# Altium schematic sheet S2C_FrontpanelInterface.SchDoc
size A4; SheetNumber: 18
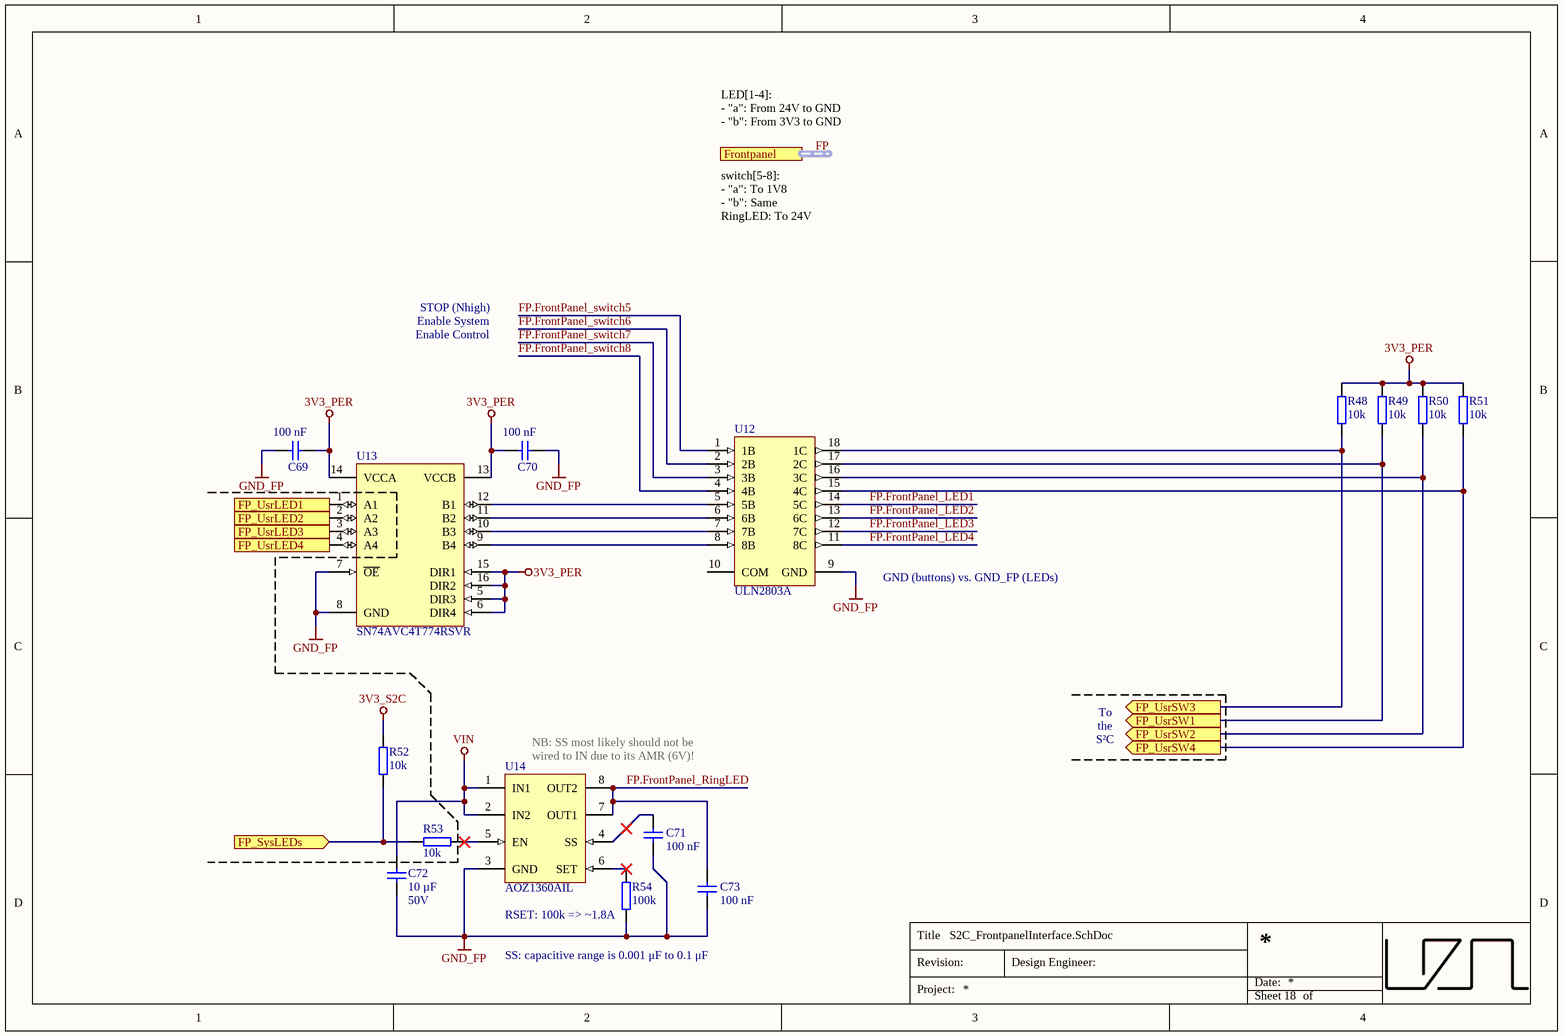
[diagram p0: S2C_FrontpanelInterface.SchDoc]

## Parts
C69  100 nF  [C_0603_TE]
C70  100 nF  [C_0603_TE]
C71  100 nF  [C_0603_TE]
C72  10 µF  Voltage: 50V  [C_1206_TE]
C73  100 nF  [C_0603_TE]
R48  10k  [R_0603_TE]
R49  10k  [R_0603_TE]
R50  10k  [R_0603_TE]
R51  10k  [R_0603_TE]
R52  10k  [R_0603_TE]
R53  10k  [R_0603_TE]
R54  100k  [R_0603_TE]
U12  ULN2803A  [FP-SOICW-18LD-PL-1-IPC_B]
U13  SN74AVC4T774RSVR  [QFN40P260X180X55-16N]
U14  AOZ1360AIL  [SOIC127P600X175-8N]

## Ports
FP_SysLEDs (in), FP_UsrLED1 (in), FP_UsrLED2 (in), FP_UsrLED3 (in), FP_UsrLED4 (in), FP_UsrSW1 (out), FP_UsrSW2 (out), FP_UsrSW3 (out), FP_UsrSW4 (out), Frontpanel (harness Frontpanel)

## Nets
3V3_PER: C69.2 C70.1 R48.2 R49.2 R50.2 R51.2 U13.5(DIR3) U13.6(DIR4) U13.13(VCCB) U13.14(VCCA) U13.15(DIR1) U13.16(DIR2)
3V3_S2C: R52.1
GND_FP: C69.1 C70.2 C71.2 C72.1 C73.2 R54.2 U12.9(GND) U13.7(~{OE}) U13.8(GND) U14.3(GND)
VIN: C72.2 U14.1(IN1) U14.2(IN2)
FP.FrontPanel_LED1: U12.14(5C)
FP.FrontPanel_LED2: U12.13(6C)
FP.FrontPanel_LED3: U12.12(7C)
FP.FrontPanel_LED4: U12.11(8C)
FP.FrontPanel_RingLED: C73.1 U14.7(OUT1) U14.8(OUT2)
FP.FrontPanel_switch5: U12.1(1B)
FP.FrontPanel_switch6: U12.2(2B)
FP.FrontPanel_switch7: U12.3(3B)
FP.FrontPanel_switch8: U12.4(4B)
FP_SysLEDs: R52.2 R53.1 ; port FP_SysLEDs
FP_UsrLED1: U13.1(A1) ; port FP_UsrLED1
FP_UsrLED2: U13.2(A2) ; port FP_UsrLED2
FP_UsrLED3: U13.3(A3) ; port FP_UsrLED3
FP_UsrLED4: U13.4(A4) ; port FP_UsrLED4
FP_UsrSW1: R49.1 U12.17(2C) ; port FP_UsrSW1
FP_UsrSW2: R50.1 U12.16(3C) ; port FP_UsrSW2
FP_UsrSW3: R48.1 U12.18(1C) ; port FP_UsrSW3
FP_UsrSW4: R51.1 U12.15(4C) ; port FP_UsrSW4
NetC71_1: C71.1 U14.4(SS)
NetR53_2: R53.2 U14.5(EN)
NetR54_1: R54.1 U14.6(SET)
NetU12_5: U12.5(5B) U13.12(B1)
NetU12_6: U12.6(6B) U13.11(B2)
NetU12_7: U12.7(7B) U13.10(B3)
NetU12_8: U12.8(8B) U13.9(B4)

Not connected (* = marked no-connect by the designer): U12 10(COM)

## Buses and harness runs
harness FP = port Frontpanel

## Notes on the sheet
- LED[1-4]:
  - "a": From 24V to GND
  - "b": From 3V3 to GND
- switch[5-8]:
  - "a": To 1V8
  - "b": Same
- RingLED: To 24V
- STOP (Nhigh)
- Enable System
- Enable Control
- GND (buttons) vs. GND_FP (LEDs)
- To
- (near U14) NB: SS most likely should not be wired to IN due to its AMR (6V)!
- the
- S²C
- (near R54) RSET: 100k => ~1.8A
- SS: capacitive range is 0.001 μF to 0.1 μF
- Title
- Revision:
- Design Engineer:
- Date:
- Project:
- Sheet
- of

## Library data of the parts
C69 C70 = UZgen_C_0603_100nF_50V_X7R: Generic capacitor; Manufacturer: UZgen; Voltage: 50V; Tolerance: 10 %; Created from: AGeiger; Manufacturer Part Number: UZgen_C_0603_100nF_50V_X7R; PartID: 1; Created On: 02/07/2024 14:42:23; Value: 100 nF; Device Package: 0603; Technology: X7R; Mounting Type: SMD; Last Updated: 08/08/2024 15:01:15
C71 C73 = UZgen_C_0603_100nF_50V_X7R: Generic capacitor; Manufacturer: UZgen; Tolerance: 10 %; Voltage: 50V; Created from: AGeiger; Technology: X7R; Value: 100 nF; Manufacturer Part Number: UZgen_C_0603_100nF_50V_X7R; PartID: 1; Created On: 02/07/2024 14:42:23; Device Package: 0603; Mounting Type: SMD; Last Updated: 08/08/2024 15:01:15
C72 = UZgen_C_1206_10uF_50V_X7R: Generic capacitor; Manufacturer: UZgen; Tolerance: 10 %; Created from: MGeier; Value: 10 µF; Manufacturer Part Number: UZgen_C_1206_10uF_50V_X7R; PartID: 5807; Created On: 20/03/2025 14:05:00; Device Package: 1206; Technology: X7R; Mounting Type: SMD; Last Updated: 20/03/2025 14:05:00
R48-R53 = UZgen_R_0603_10k: Generic resistor; Manufacturer: UZgen; Tolerance: 1 %; Created from: AGeiger; Manufacturer Part Number: UZgen_R_0603_10k; PartID: 1; Created On: 02/07/2024 14:34:53; Value: 10k; Device Package: 0603; Mounting Type: SMD; Last Updated: 02/07/2024 14:37:16
R54 = UZgen_R_0603_100k: Generic resistor; Manufacturer: UZgen; Tolerance: 1 %; Created from: UZgenTool; Value: 100k; Manufacturer Part Number: UZgen_R_0603_100k; PartID: 268; Created On: 02/07/2024 17:29:50; Device Package: 0603; Mounting Type: SMD; Last Updated: 02/07/2024 17:29:50
U12 = ULN2803A: Darlington Transistors Eight NPN Array; Manufacturer: UMW(Youtai Semiconductor Co., Ltd.); Created from: FRosner; Manufacturer Part Number: ULN2803A; PartID: 17; Created On: 13/06/2024 09:08:03; ComponentLink1Description: Datasheet; ComponentLink1URL: https://wmsc.lcsc.com/wmsc/upload/file/pdf/v2/lcsc/2311091738_UMW-Youtai-Semiconductor-Co---Ltd--ULN2803A_C845537.pdf; Component Type: Darlington Driver; Device Package: SOP-18; Last Updated: 04/09/2024 11:48:15; Mounting Type: SMT; Operating Temperature: -40~85 °C; Series: ULN2803A; Supplier 1: LCSC; Supplier Part Number 1: C845537; Type: Driver; Live Cycle Status: 1; LCSC Part Number: C845537
U13 = SN74AVC4T774RSVR: 4-Bit Dual-Supply Bus Transceiver with configurable Voltage-Level Shifting; belongs to SN74AVC4T774RSVR; Manufacturer: Texas Instruments; Created from: MGremer; Manufacturer Part Number: SN74AVC4T774RSVR; PartID: 1; Created On: 30/11/2020 12:34:01; ComponentLink1Description: Datasheet; ComponentLink1URL: https://www.ti.com/store/ti/en/p/product/?p=SN74AVC4T774RSVR; Component Type: Level Shifter; Device Package: UQFN; Last Updated: 03/09/2024 12:45:00; Mounting Type: SMD; Supplier 1: Mouser; Supplier Part Number 1: 595-SN74AVC4T774RSVR; Supplier 2: LCSC; Supplier Part Number 2: C779392; Type: Level Shifter; Live Cycle Status: 1; LCSC Part Number: C779392; Stock number: not stored
U14 = AOZ1360AIL: 28V 3.4A Programmable Current-Limited High-Side Load Switch; Manufacturer: Alpha and Omega Semiconductor; Created from: MGeier; ComponentLink1URL: https://www.lcsc.com/datasheet/lcsc_datasheet_1809131557_Alpha---Omega-Semicon-AOZ1360AIL_C146821.pdf; ComponentLink1Description: Datasheet; Manufacturer Part Number: AOZ1360AIL; PartID: 9; Created On: 24/02/2025 16:37:30; Component Type: Power Switch ICs; Device Package: SO-8; Last Updated: 24/02/2025 16:37:30; Mounting Type: SMD; Operating Temperature: -40°C - 85°C; Series: AOZ1360; Supplier 1: LCSC; Supplier Part Number 1: C146821; Value: AOZ1360AIL; LCSC Part Number: C146821